# Altium schematic sheet Alarm_Clock.SchDoc
size 381 x 330 mm; SheetNumber: 1; SheetTotal: 1
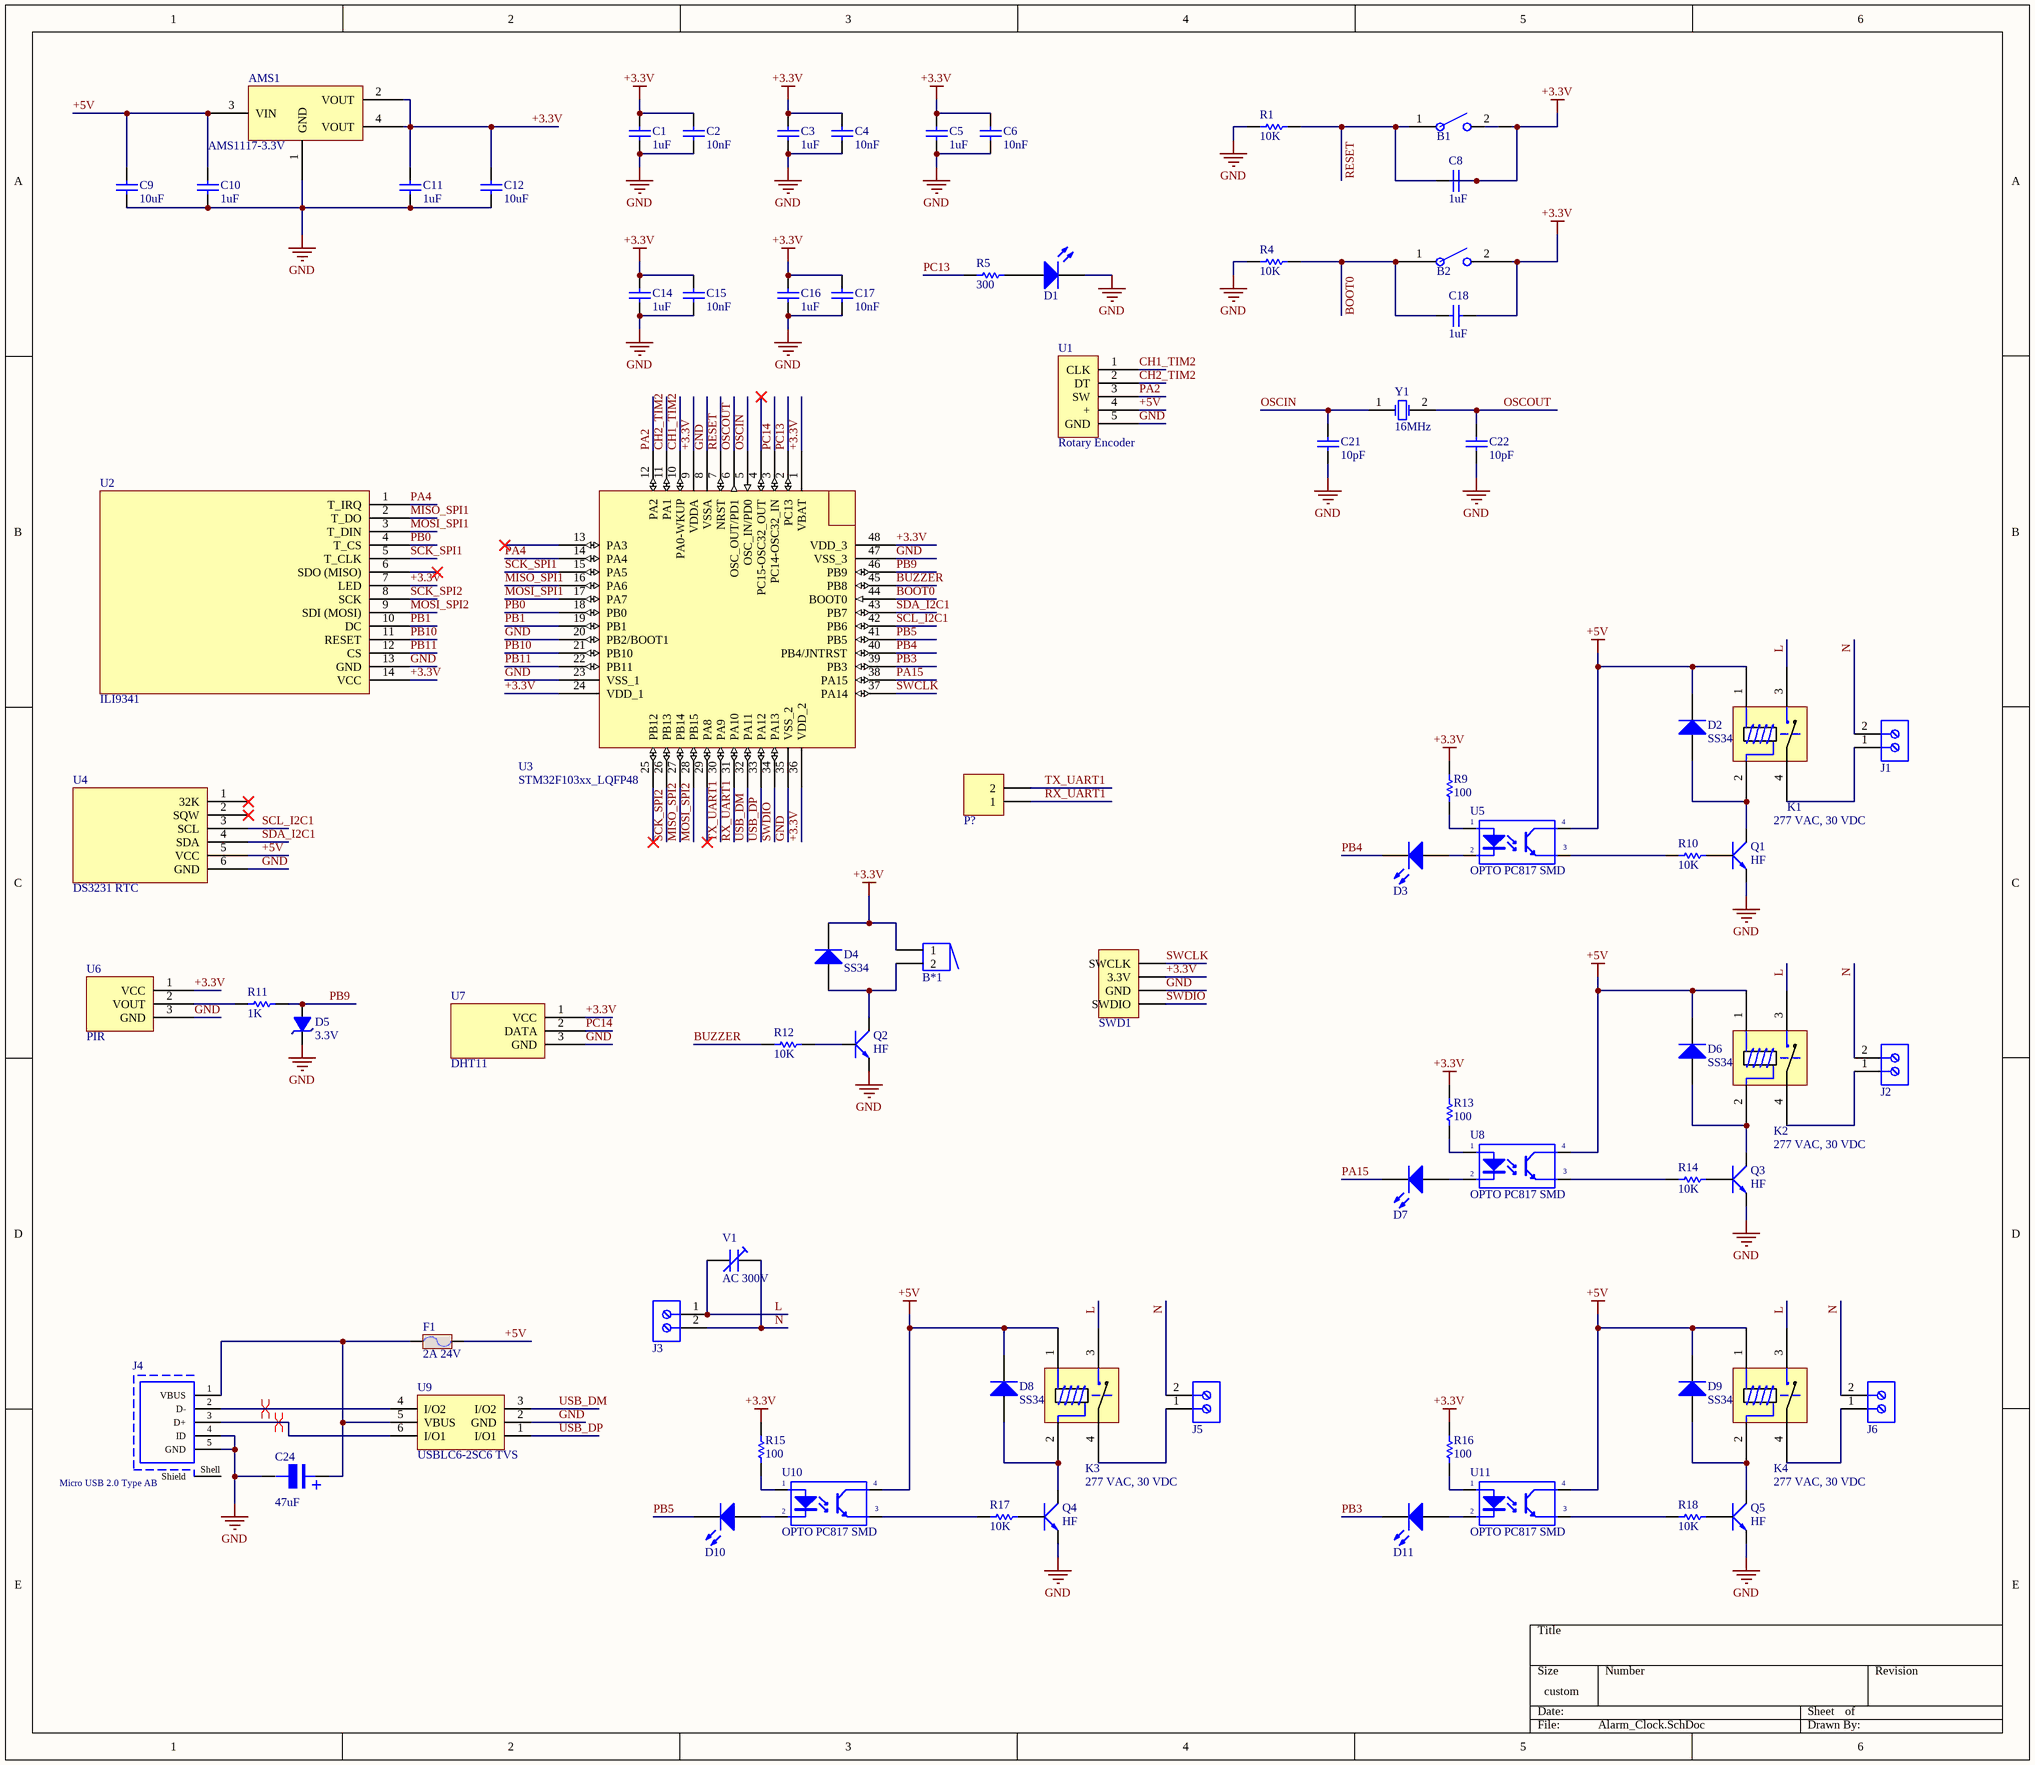
[diagram p0: Alarm_Clock.SchDoc]

## Parts
AMS1  AMS1117-3.3V  [SOT223]
B1  Button SMD 2 Pin 3x4mm  [BUTTON SMD 2 PIN]  (value not drawn)
B2  Button SMD 2 Pin 3x4mm  [BUTTON SMD 2 PIN]  (value not drawn)
B*1  Buzzer  [BUZZER]  (value not drawn)
C1  value 1uF  [CAP-SM-0805]  (hidden comment: Cap Non-Pol SMD)
C2  value 10nF  [CAP-SM-0805]  (hidden comment: Cap Non-Pol SMD)
C3  value 1uF  [CAP-SM-0805]  (hidden comment: Cap Non-Pol SMD)
C4  value 10nF  [CAP-SM-0805]  (hidden comment: Cap Non-Pol SMD)
C5  value 1uF  [CAP-SM-0805]  (hidden comment: Cap Non-Pol SMD)
C6  value 10nF  [CAP-SM-0805]  (hidden comment: Cap Non-Pol SMD)
C8  value 1uF  [CAP-SM-0805]  (hidden comment: Cap Non-Pol SMD)
C9  value 10uF  [CAP-SM-0805]  (hidden comment: Cap Non-Pol SMD)
C10  value 1uF  [CAP-SM-0805]  (hidden comment: Cap Non-Pol SMD)
C11  value 1uF  [CAP-SM-0805]  (hidden comment: Cap Non-Pol SMD)
C12  value 10uF  [CAP-SM-0805]  (hidden comment: Cap Non-Pol SMD)
C14  value 1uF  [CAP-SM-0805]  (hidden comment: Cap Non-Pol SMD)
C15  value 10nF  [CAP-SM-0805]  (hidden comment: Cap Non-Pol SMD)
C16  value 1uF  [CAP-SM-0805]  (hidden comment: Cap Non-Pol SMD)
C17  value 10nF  [CAP-SM-0805]  (hidden comment: Cap Non-Pol SMD)
C18  value 1uF  [CAP-SM-0805]  (hidden comment: Cap Non-Pol SMD)
C21  value 10pF  [CAP-SM-0805]  (hidden comment: Cap Non-Pol SMD)
C22  value 10pF  [CAP-SM-0805]  (hidden comment: Cap Non-Pol SMD)
C24  47uF  [tu nhom 6.3 (d)]
D1  LED SMD  [LED_0603_Blue]  (value not drawn)
D2  SS34  [DIODE SMA]
D3  LED SMD  [LED_0805_Blue]  (value not drawn)
D4  SS34  [DIODE SMA]
D5  3.3V  [DIODE ZENNER SMD SOD80]
D6  SS34  [DIODE SMA]
D7  LED SMD  [LED_0805_Blue]  (value not drawn)
D8  SS34  [DIODE SMA]
D9  SS34  [DIODE SMA]
D10  LED SMD  [LED_0805_Blue]  (value not drawn)
D11  LED SMD  [LED_0805_Blue]  (value not drawn)
F1  2A 24V  [Cau chi tu phuc hoi 2A 24V SMD1812]
J1  10A, 300V  [691214110002]  (value not drawn)
J2  10A, 300V  [691214110002]  (value not drawn)
J3  10A, 300V  [691214110002]  (value not drawn)
J4  Micro USB 2.0 Type AB  [629105150921]
J5  10A, 300V  [691214110002]  (value not drawn)
J6  10A, 300V  [691214110002]  (value not drawn)
K1  277 VAC, 30 VDC  [HF46F]
K2  277 VAC, 30 VDC  [HF46F]
K3  277 VAC, 30 VDC  [HF46F]
K4  277 VAC, 30 VDC  [HF46F]
P?  Header 2  [JP2]  (value not drawn)
Q1  HF  [SOT-23]
Q2  HF  [SOT-23]
Q3  HF  [SOT-23]
Q4  HF  [SOT-23]
Q5  HF  [SOT-23]
R1  value 10K  [RES-SM-0805]  (hidden comment: RESISTOR SMD)
R4  value 10K  [RES-SM-0805]  (hidden comment: RESISTOR SMD)
R5  value 300  [RES-SM-0805]  (hidden comment: RESISTOR SMD)
R9  value 100  [RES-SM-0805]  (hidden comment: RESISTOR SMD)
R10  value 10K  [RES-SM-0805]  (hidden comment: RESISTOR SMD)
R11  value 1K  [RES-SM-0805]  (hidden comment: RESISTOR SMD)
R12  value 10K  [RES-SM-0805]  (hidden comment: RESISTOR SMD)
R13  value 100  [RES-SM-0805]  (hidden comment: RESISTOR SMD)
R14  value 10K  [RES-SM-0805]  (hidden comment: RESISTOR SMD)
R15  value 100  [RES-SM-0805]  (hidden comment: RESISTOR SMD)
R16  value 100  [RES-SM-0805]  (hidden comment: RESISTOR SMD)
R17  value 10K  [RES-SM-0805]  (hidden comment: RESISTOR SMD)
R18  value 10K  [RES-SM-0805]  (hidden comment: RESISTOR SMD)
SWD1  Header 4  [JP4]  (value not drawn)
U1  Rotary Encoder  [Header 5 Pin]
U2  ILI9341  [ILI9341]
U3  STM32F103xx_LQFP48  [STM32_LQPF48]
U4  DS3231 RTC  [DS3231]
U5  OPTO PC817 SMD  [SOP4]
U6  PIR  [PIR]
U7  DHT11  [DHT11]
U8  OPTO PC817 SMD  [SOP4]
U9  USBLC6-2SC6 TVS  [SOT23-6]
U10  OPTO PC817 SMD  [SOP4]
U11  OPTO PC817 SMD  [SOP4]
V1  AC 300V  [Varistor]
Y1  16MHz  [WE-XTAL_HC49/4HSMX]

## Nets
+3.3V: AMS1.2(VOUT) AMS1.4(VOUT) B1.2 B2.2 B*1.1 C1.2 C2.2 C3.2 C4.2 C5.2 C6.2 C8.2 C11.2 C12.2 C14.2 C15.2 C16.2 C17.2 C18.2 D4.2(K) R9.2 R13.2 R15.2 R16.2 SWD1.3(3.3V) U2.7(LED) U2.14(VCC) U3.1(VBAT) U3.9(VDDA) U3.24(VDD_1) U3.36(VDD_2) U3.48(VDD_3) U6.1(VCC) U7.1(VCC)
+5V: AMS1.3(VIN) C9.2 C10.2 D2.2(K) D6.2(K) D8.2(K) D9.2(K) F1.2 K1.1(Coil) K2.1(Coil) K3.1(Coil) K4.1(Coil) U1.4(+) U4.5(VCC) U5.4(C) U8.4(C) U10.4(C) U11.4(C)
GND: AMS1.1(GND) C1.1 C2.1 C3.1 C4.1 C5.1 C6.1 C9.1 C10.1 C11.1 C12.1 C14.1 C15.1 C16.1 C17.1 C21.2 C22.2 C24.2 D1.2(K) D5.2(K) J4.4(ID) J4.5(GND) Q1.2(E) Q2.2(E) Q3.2(E) Q4.2(E) Q5.2(E) R1.1 R4.1 SWD1.2(GND) U1.5(GND) U2.13(GND) U3.8(VSSA) U3.20(PB2/BOOT1) U3.23(VSS_1) U3.35(VSS_2) U3.47(VSS_3) U4.6(GND) U6.3(GND) U7.3(GND) U9.2(GND)
BOOT0: B2.1 C18.1 R4.2 U3.44(BOOT0)
BUZZER: R12.1 U3.45(PB8)
CH1_TIM2: U1.1(CLK) U3.10(PA0-WKUP)
CH2_TIM2: U1.2(DT) U3.11(PA1)
L: J3.1 K1.3(NO) K2.3(NO) K3.3(NO) K4.3(NO) V1.1
MISO_SPI1: U2.2(T_DO) U3.16(PA6)
MISO_SPI2: U3.27(PB14)
MOSI_SPI1: U2.3(T_DIN) U3.17(PA7)
MOSI_SPI2: U2.9(SDI_(MOSI)) U3.28(PB15)
N: J1.2 J2.2 J3.2 J5.2 J6.2 V1.2
OSCIN: C21.1 U3.5(OSC_IN/PD0) Y1.1(OSC1)
OSCOUT: C22.1 U3.6(OSC_OUT/PD1) Y1.2(OSC2)
PA2: U1.3(SW) U3.12(PA2)
PA4: U2.1(T_IRQ) U3.14(PA4)
PA15: D7.2(K) U3.38(PA15)
PB0: U2.4(T_CS) U3.18(PB0)
PB1: U2.10(DC) U3.19(PB1)
PB3: D11.2(K) U3.39(PB3)
PB4: D3.2(K) U3.40(PB4/JNTRST)
PB5: D10.2(K) U3.41(PB5)
PB9: D5.1(A) R11.2 U3.46(PB9)
PB10: U2.11(RESET) U3.21(PB10)
PB11: U2.12(CS) U3.22(PB11)
PC13: R5.1 U3.2(PC13)
PC14: U3.3(PC14-OSC32_IN) U7.2(DATA)
RESET: B1.1 C8.1 R1.2 U3.7(NRST)
RX_UART1: P?.1 U3.31(PA10)
SCK_SPI1: U2.5(T_CLK) U3.15(PA5)
SCK_SPI2: U2.8(SCK) U3.26(PB13)
SCL_I2C1: U3.42(PB6) U4.3(SCL)
SDA_I2C1: U3.43(PB7) U4.4(SDA)
SWCLK: SWD1.4(SWCLK) U3.37(PA14)
SWDIO: SWD1.1(SWDIO) U3.34(PA13)
TX_UART1: P?.2 U3.30(PA9)
USB_DM: U3.32(PA11) U9.3(I/O2)
USB_DP: U3.33(PA12) U9.1(I/O1)
NetB*1_2: B*1.2 D4.1(A) Q2.3(C)
NetC24_1: C24.1 F1.1 J4.1(VBUS) U9.5(VBUS)
NetD1_1: D1.1(A) R5.2
NetD2_1: D2.1(A) K1.2(Coil) Q1.3(C)
NetD3_1: D3.1(A) U5.2(K)
NetD6_1: D6.1(A) K2.2(Coil) Q3.3(C)
NetD7_1: D7.1(A) U8.2(K)
NetD8_1: D8.1(A) K3.2(Coil) Q4.3(C)
NetD9_1: D9.1(A) K4.2(Coil) Q5.3(C)
NetD10_1: D10.1(A) U10.2(K)
NetD11_1: D11.1(A) U11.2(K)
NetJ1_1: J1.1 K1.4
NetJ2_1: J2.1 K2.4
NetJ4_2: J4.2(D-) U9.4(I/O2)
NetJ4_3: J4.3(D+) U9.6(I/O1)
NetJ5_1: J5.1 K3.4
NetJ6_1: J6.1 K4.4
NetQ1_1: Q1.1(B) R10.1
NetQ2_1: Q2.1(B) R12.2
NetQ3_1: Q3.1(B) R14.1
NetQ4_1: Q4.1(B) R17.1
NetQ5_1: Q5.1(B) R18.1
NetR9_1: R9.1 U5.1(A)
NetR10_2: R10.2 U5.3(E)
NetR11_1: R11.1 U6.2(VOUT)
NetR13_1: R13.1 U8.1(A)
NetR14_2: R14.2 U8.3(E)
NetR15_1: R15.1 U10.1(A)
NetR16_1: R16.1 U11.1(A)
NetR17_2: R17.2 U10.3(E)
NetR18_2: R18.2 U11.3(E)

Not connected (* = marked no-connect by the designer): J4 Shell(Shield); U2 6(SDO_(MISO))*; U3 4(PC15-OSC32_OUT)* 13(PA3)* 25(PB12)* 29(PA8)*; U4 1(32K)* 2(SQW)*

## Layout directives
differential pair: NetJ4_2, NetJ4_3

## Notes on the sheet
- (in symbol Tu Nhom 47uF 50V) +

## Library data of the parts
AMS1 = AMS1117 SMD: Dán; Value: AMS1117-3.3V SOT223; Don_Vi: Con; Ma_Hang: MH000596; Ghi_Chu: *; Kieu_Chan: *; Chung_Loai: Dán
B1 B2 = BUTTON
C1-C6 C8-C12 C14-C18 C21 C22 = Cap Non-Pol SMD: Capacitor
C24 = Tu Nhom 47uF 50V: Dán; Don_Vi: Con; So_Chan: 2; Ten_Linh_Kien: Tụ Nhôm 47uF 50V 6.3x5.5MM; Ma_Hang: MH002217; Chung_Loai: Dán; Kieu_Chan: *
D1 D3 D7 D10 D11 = LED SMD: LED
D2 D4 D6 D8 D9 = Diode SS34 ( 1N5822 ): Dán; Don_Vi: Con; Ma_Hang: MH002104; Ten_Linh_Kien: Diode SS34 3A 40V SMA ( 1N5822 SS34A); Kieu_Chan: *; Chung_Loai: Dán
D5 = Diode Zener 3.3V: Dán; Don_Vi: Con; Ma_Hang: MH002880; Ten_Linh_Kien: Diode Zener 1/2W 3.3V SMD1206 ZMM3.3; Kieu_Chan: *; Ghi_Chu: *; Chung_Loai: Dán
F1 = Cau chi tu phuc hoi 2A 24V SMD1812: 2A 24V SMD1812; Ma_Hang: MH010033; Ten: Cầu Chì Tự Phục Hồi 2A 24V SMD1812
J1-J3 J5 J6 = 691214110002: WR-TBL Series 2141 Horizontal Entry Modular, THT, pitch 3.5mm, 2p; Manufacturer: Wurth Elektronik; Modularity: Yes; ComponentLink1Description: Website Link; ComponentLink1URL: https://www.we-online.com/redexpert/article/691214110002?ad; ComponentLink2Description: Supplier 1 URL; ComponentLink2URL: N/A; Manufacturer Part Number: 691214110002; Category: Terminal Blocks; Match Code: WR-TBL; Mount: Through Hole; Operating Temperature Max: 105°C; Operating Temperature Min: -40°C; Packaging: Box; Application: Rising Cage Clamp; Number of Pins: 2; Number of Rows: 1; Orientation: Horizontal; Pitch: 3.5mm; Rated Current: 10A; Working Voltage: 300V; ComponentLink3Description: Supplier 2 URL; ComponentLink3URL: N/A; ComponentLink4Description: Supplier 3 URL; ComponentLink4URL: https://www.thegioiic.com/kf350-2-v-domino-2-chan-thang-3-5mm-300v-10a-han-pcb; Supplier 1 Name: Mouser; Supplier 1 SN: N/A; Supplier 1 URL: N/A; Supplier 2 Name: Digi-Key; Supplier 2 SN: N/A; Supplier 2 URL: N/A; Supplier 3 Name: thegioiic; Supplier 3 SN: N/A; Supplier 3 URL: https://www.thegioiic.com/kf350-2-v-domino-2-chan-thang-3-5mm-300v-10a-han-pcb; Value: 10A, 300V
J4 = 629105150921: Micro USB 2.0 Type AB Receptacle WR-COM, Horizontal, SMT; Rated Current: 1.8 A; Contact Resistance: 30 mOhm; Working Voltage: 30 VAC; ComponentLink1Description: Datasheet; ComponentLink1URL: https://katalog.we-online.de/em/datasheet/629105150921.pdf; ComponentLink2Description: Supplier 1 URL; ComponentLink2URL: N/A; Part Number: 629105150921; Published Date: September 2018; Publisher: Wurth Elektronik; Orientation: Horizontal; Connector Type: Micro USB 2.0 Type AB; Operating Temperature: -40 to 85 degC; Mounting Technology: SMT; Gender: Receptacle; Packaging: Tape and Reel; ComponentLink3Description: Supplier 2 URL; ComponentLink3URL: N/A; ComponentLink4Description: Supplier 3 URL; ComponentLink4URL: N/A; Supplier 1 Name: Mouser; Supplier 1 SN: 710-629105150921; Supplier 1 URL: https://www.mouser.vn/ProductDetail/Wurth-Elektronik/629105150921?qs=a9WhcLg8qCztfCBvRE9gEg%3D%3D; Supplier 2 Name: Digi-Key; Supplier 2 SN: N/A; Supplier 2 URL: N/A; Supplier 3 Name: thegioiic; Supplier 3 SN: N/A; Supplier 3 URL: N/A; Value: Micro USB 2.0 Type AB
K1-K4 = HF46F-G 12-HS1: Coil Voltage: 12 VDC; Contact Current Rating: 7A; Switching Voltage Max: 277 VAC, 30 VDC; Coil Voltage: 12 VDC; Associated Relay Series: N/A; Coil Current: N/A; Coil Resistance: N/A; ComponentLink1Description: Datasheet link; ComponentLink1URL: https://source.hongfa.com//pdf/web/viewer.html?file=/Uploads/Product/PDF/HF46F-G_en.pdf?timestamp=1691116874; ComponentLink2Description: Supplier 1 URL; ComponentLink2URL: N/A; ComponentLink3Description: Supplier 2 URL; ComponentLink3URL: N/A; ComponentLink4Description: Supplier 3 URL; ComponentLink4URL: https://www.thegioiic.com/hf46f-g-12-hs1-ro-le-12vdc-7a-spst-no-4-chan; Power Consumption: N/A; Supplier 1 Name: Mouser; Supplier 1 SN: N/A; Supplier 1 URL: N/A; Supplier 2 Name: Digi-Key; Supplier 2 SN: N/A; Supplier 2 URL: N/A; Supplier 3 Name: thegioiic; Supplier 3 SN: N/A; Supplier 3 URL: https://www.thegioiic.com/hf46f-g-12-hs1-ro-le-12vdc-7a-spst-no-4-chan; Value: 277 VAC, 30 VDC
P? = Header 2: Header, 2-Pin; LatestRevisionDate: 17-Jul-2002; LatestRevisionNote: Re-released for DXP Platform.; Publisher: Altium Limited
Q1-Q5 = Trans C1815 HF SMD: SOT-23; Value: C9014
R1 R4 R5 R9-R18 = RESISTOR SMD: Resistor
SWD1 = Header 4: Header, 4-Pin; LatestRevisionDate: 17-Jul-2002; LatestRevisionNote: Re-released for DXP Platform.; Publisher: Altium Limited
U2 = ILI9341: ILI9341 Module 3.2 240x320
U4 = DS3231: DS3231 RTC Module
U5 U8 U10 U11 = OPTO PC817 SMD: Single Opto; Value: PC817
U9 = IC_LTC6992IS6-1: Oscillator, Silicon IC 3.81Hz ~ 1MHz TSOT-23-6; Manufacturer: Linear Technology/Analog Devices; Alternate Part Number-1: NA; Manufacturer Part Number: LTC6992IS6-1; Case/Package: SOT-23-6; Supplier-1: Arrow; Supplier Part Number-1: LTC6992IS6-1#TRMPBF
V1 = 05000730110: Varistors 7D471K AC 300V; Manufacture  Name: Bourns; Tolerance: +/- 10%; Diameter: 7mm; Capacitance: N/A; ComponentLink1Description: Datasheet link; ComponentLink1URL: N/A; Voltage: 300V; Manufacture  SN: 7D471K; ComponentLink2Description: Supplier 1 URL; ComponentLink2URL: N/A; ComponentLink3Description: Supplier 2 URL; ComponentLink3URL: N/A; ComponentLink4Description: Supplier 3 URL; ComponentLink4URL: N/A; Supplier 1 Name: Mouser; Supplier 1 SN: N/A; Supplier 1 URL: N/A; Supplier 2 Name: Digi-Key; Supplier 2 SN: N/A; Supplier 2 URL: N/A; Supplier 3 Name: thegioiic; Supplier 3 SN: N/A; Supplier 3 URL: https://www.thegioiic.com/tu-chong-set-varistor-7d471k-300v; Value: AC 300V
Y1 = 071105166016: WE-XTAL Quartz Crystal, SMT, HC49/4HSMX, 16MHz, +/-30ppm; Manufacturer Part Number: 830003237; Manufacturer: Wurth Elektronik; Frequency Stability: +/-50ppm; Load Capacitance: 16pF; ComponentLink2Description: Supplier 1 URL; ComponentLink2URL: https://www.mouser.com/ProductDetail/Wurth-Elektronik/830003237?qs=2WXlatMagcFy7La1wROd1w%3D%3D; Operating Temperature: -10 to +60degC; Size: HC49/4HSMX; Frequency: 16MHz; Frequency Tolerance: +/-30ppm; Mounting Technology: SMT; Supplier 3 Name: thegioiic; Supplier 3 SN: N/A; Supplier 3 URL: https://www.thegioiic.com/thach-anh-16mhz-2-chan-smd-hc49-s; ComponentLink1Description: Datasheet link; ComponentLink1URL: https://katalog.we-online.com/pbs/datasheet/830003237.pdf; ComponentLink3Description: Supplier 2 URL; ComponentLink3URL: https://www.digikey.com/en/products/detail/w%C3%BCrth-elektronik/830003237/13979248; ComponentLink4Description: Supplier 3 URL; ComponentLink4URL: https://www.thegioiic.com/thach-anh-16mhz-2-chan-smd-hc49-s; Supplier 1 Name: Mouser; Supplier 1 SN: 710-830003237; Supplier 1 URL: https://www.mouser.com/ProductDetail/Wurth-Elektronik/830003237?qs=2WXlatMagcFy7La1wROd1w%3D%3D; Supplier 2 Name: Digi-Key; Supplier 2 SN: 732-830003237TR-ND; Supplier 2 URL: https://www.digikey.com/en/products/detail/w%C3%BCrth-elektronik/830003237/13979248; Value: 16MHz
U3 = STM32F103xx_LQFP48: Published: 30-May-2008; DatasheetVersion: rev6, Mar-2008; PackageVersion: Mar-2008; PackageReference: LQFP48; Publisher: Altium Limited; PackageDescription: 48-Pin Low-Profile Quad Flat Pack, 7 x 7 mm Body, 0.5 mm Pitch (LQFP48); ComponentLink1Description: Manufacturer Link; ComponentLink1URL: www.st.com/stm32; ComponentLink2Description: Datasheet; ComponentLink2URL: http://www.st.com/stonline/products/literature/ds/13587.pdf